# Altium schematic sheet Crystal_Reset_Boot.SchDoc: LPC4330 Reset / Crystal / JTAG/ BOOT / RTC
size A; DrawnBy: Adam Vadala-Roth; DocumentNumber: 3; Revision: 2.4b; SheetNumber: 3; SheetTotal: 9
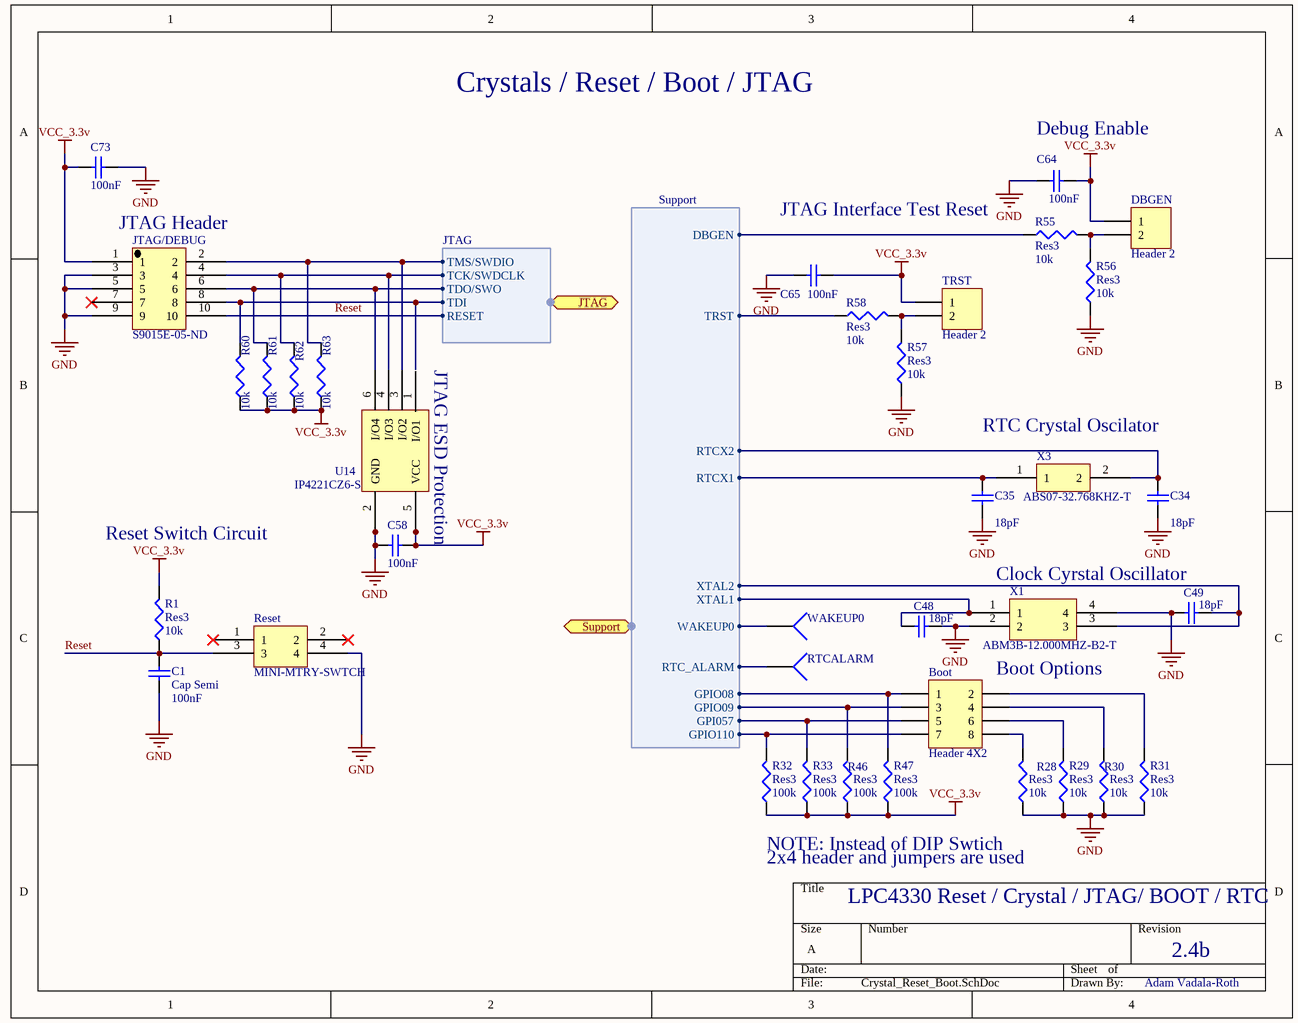
[diagram p0: Crystal_Reset_Boot.SchDoc]

## Parts
Boot  Header 4X2  [HDR2X4]
C1  Cap Semi  C1: 100nF  [CAPC1608L]
C34  value 18pF  [1608[0603]]  (hidden comment: Cap Semi)
C35  value 18pF  [1608[0603]]  (hidden comment: Cap Semi)
C48  value 18pF  [1608[0603]]  (hidden comment: Cap Semi)
C49  value 18pF  [1608[0603]]  (hidden comment: Cap Semi)
C58  C1: 100nF  [CAPC1608L]  (hidden comment: Cap Semi)
C64  C1: 100nF  [CAPC1608L]  (hidden comment: Cap Semi)
C65  C1: 100nF  [CAPC1608L]  (hidden comment: Cap Semi)
C73  C1: 100nF  [CAPC1608L]  (hidden comment: Cap Semi)
DBGEN  Header 2  [HDR1X2]
JTAG/DEBUG  S9015E-05-ND  [S9015E-05-ND]
R1  Res3  value 10k  [J1-0603]
R28  Res3  value 10k  [J1-0603]
R29  Res3  value 10k  [J1-0603]
R30  Res3  value 10k  [J1-0603]
R31  Res3  value 10k  [J1-0603]
R32  Res3  value 100k  [J1-0603]
R33  Res3  value 100k  [J1-0603]
R46  Res3  value 100k  [J1-0603]
R47  Res3  value 100k  [J1-0603]
R55  Res3  value 10k  [J1-0603]
R56  Res3  value 10k  [J1-0603]
R57  Res3  value 10k  [J1-0603]
R58  Res3  value 10k  [J1-0603]
R60  value 10k  [J1-0603]  (hidden comment: Res3)
R61  value 10k  [J1-0603]  (hidden comment: Res3)
R62  value 10k  [J1-0603]  (hidden comment: Res3)
R63  value 10k  [J1-0603]  (hidden comment: Res3)
Reset  MINI-MTRY-SWTCH  [Momentary Switch]
RTCALARM  Socket  [PIN1]  (value not drawn)
TRST  Header 2  [HDR1X2]
U14  IP4221CZ6-S  [IP4221CZ6-S]
WAKEUP0  Socket  [PIN1]  (value not drawn)
X1  ABM3B-12.000MHZ-B2-T  [ABM3B-12.000MHZ-B2-T]
X3  ABS07-32.768KHZ-T  [ABS07-32.768KHZ-T]

## Ports
JTAG (harness JTAG), Support (harness Support)

## Harnesses
JTAG: TDI, TDO/SWO, TCK/SWDCLK, TMS/SWDIO, RESET
Support: GPIO08, GPIO09, GPI057, GPIO110, RTC_ALARM, WAKEUP0, XTAL2, XTAL1, RTCX2, RTCX1, TRST, DBGEN

## Nets
GND: C1.1 C34.1 C35.1 C48.1 C49.2 C58.1 C64.1 C65.1 C73.2 JTAG/DEBUG.3 JTAG/DEBUG.5 JTAG/DEBUG.9 R28.1 R29.1 R30.1 R31.1 R56.1 R57.1 Reset.4 U14.2(GND) X1.2 X1.4
VCC_3.3v: C58.2 C64.2 C65.2 C73.1 DBGEN.1 JTAG/DEBUG.1 R1.2 R32.1 R33.1 R46.1 R47.1 R60.1 R61.1 R62.1 R63.1 TRST.1 U14.5(VCC)
Reset: C1.2 JTAG/DEBUG.10 R1.1 Reset.3 ; port JTAG.RESET
NetBoot_1: Boot.1 R47.2 ; port Support.GPIO08
NetBoot_2: Boot.2 R31.2
NetBoot_3: Boot.3 R46.2 ; port Support.GPIO09
NetBoot_4: Boot.4 R30.2
NetBoot_5: Boot.5 R33.2 ; port Support.GPI057
NetBoot_6: Boot.6 R29.2
NetBoot_7: Boot.7 R32.2 ; port Support.GPIO110
NetBoot_8: Boot.8 R28.2
NetC34_2: C34.2 X3.2 ; port Support.RTCX2
NetC35_2: C35.2 X3.1 ; port Support.RTCX1
NetC48_2: C48.2 X1.1 ; port Support.XTAL1
NetC49_1: C49.1 X1.3 ; port Support.XTAL2
NetDBGEN_2: DBGEN.2 R55.2 R56.2
NetJTAG/DEBUG_2: JTAG/DEBUG.2 R63.2 U14.3(I/O2) ; port JTAG.TMS/SWDIO
NetJTAG/DEBUG_4: JTAG/DEBUG.4 R62.2 U14.4(I/O3) ; port JTAG.TCK/SWDCLK
NetJTAG/DEBUG_6: JTAG/DEBUG.6 R61.2 U14.6(I/O4) ; port JTAG.TDO/SWO
NetJTAG/DEBUG_8: JTAG/DEBUG.8 R60.2 ; port JTAG.TDI
NetR55_1: R55.1 ; port Support.DBGEN
NetR57_2: R57.2 R58.2 TRST.2
NetR58_1: R58.1 ; port Support.TRST
NetRTCALARM_1: RTCALARM.1 ; port Support.RTC_ALARM
NetWAKEUP0_1: WAKEUP0.1 ; port Support.WAKEUP0

Not connected (* = marked no-connect by the designer): JTAG/DEBUG 7*; Reset 1* 2*; U14 1(I/O1)

## Notes on the sheet
- Crystals / Reset / Boot / JTAG
- (near C64) Debug Enable
- (near JTAG/DEBUG) JTAG Header
- (near R55) JTAG Interface Test Reset
- (near U14) JTAG ESD Protection
- RTC Crystal Oscilator
- Reset Switch Circuit
- Clock Cyrstal Oscillator
- Boot Options
- NOTE: Instead of DIP Swtich
- 2x4 header and jumpers are used
- Adam Vadala-Roth

## Library data of the parts
Boot = Header 4X2: Header, 4-Pin, Dual row; LatestRevisionDate: 17-Jul-2002; LatestRevisionNote: Re-released for DXP Platform.; Publisher: Altium Limited
C1 C34 C35 C48 C49 C58 C64 C65 C73 = Cap Semi: Capacitor (Semiconductor SIM Model); Published: 8-Jun-2000; LatestRevisionDate: 29-May-2009; LatestRevisionNote: IPC-7351 Footprint Added.; PackageReference: C1206; Publisher: Altium Limited; PackageDescription: Chip Capacitor
DBGEN TRST = Header 2: Header, 2-Pin; LatestRevisionDate: 17-Jul-2002; LatestRevisionNote: Re-released for DXP Platform.; Publisher: Altium Limited
R1 R28-R33 R46 R47 R55-R58 R60-R63 = Res3: Resistor; Published: 8-Jun-2000; LatestRevisionDate: 29-May-2009; LatestRevisionNote: IPC-7351 Footprint Added.; PackageReference: J1-0603; Publisher: Altium Limited; PackageDescription: Chip Resistor
Reset = Mini Momemtary Switch
X3 = ABS07-32.768KHZ-T: ABS07-32.768KHZ-T RTC Crystal Oscillator
RTCALARM WAKEUP0 = Socket: LatestRevisionDate: 17-Jul-2002; LatestRevisionNote: Re-released for DXP Platform.; Publisher: Altium Limited